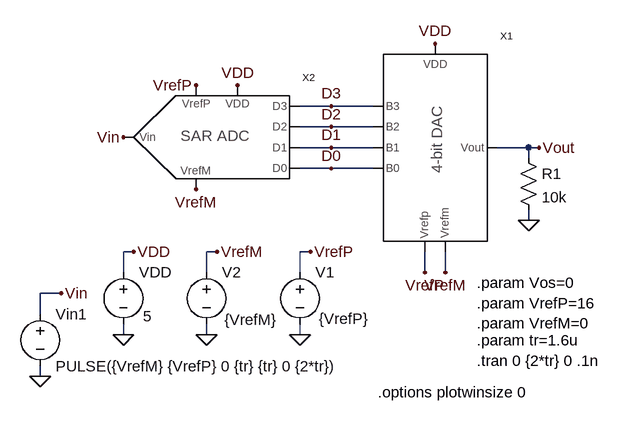
[diagram p0: schematic Fig29_36.asc]
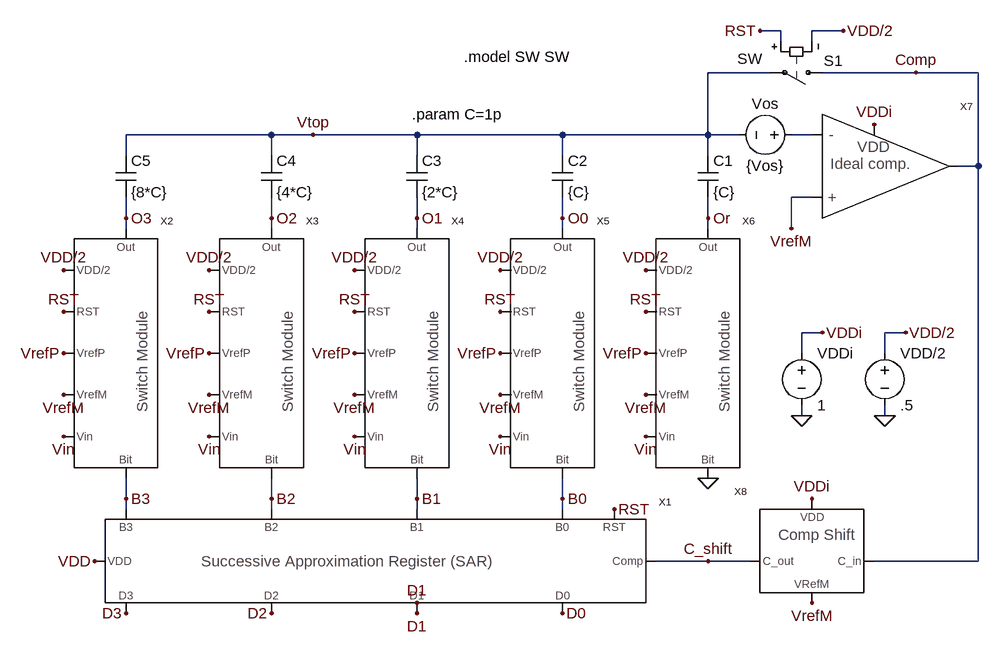
[diagram p1: sub-circuit sar_adc_4bit.asc]
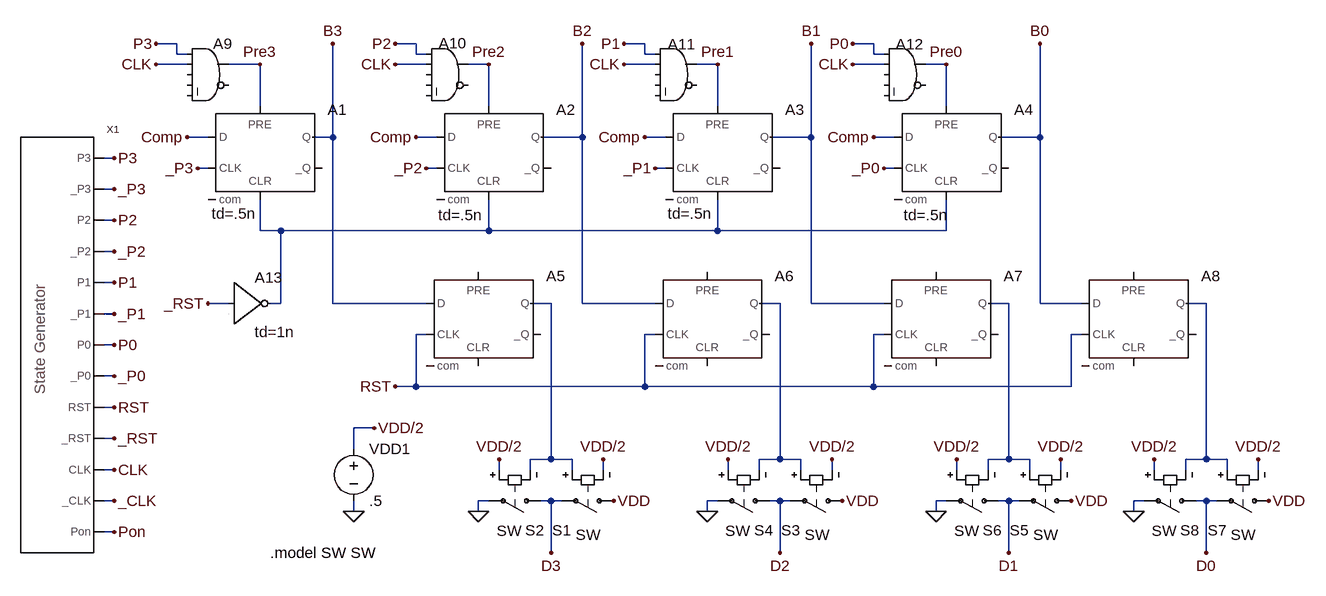
[diagram p2: sub-circuit successiveapproximationregister.asc]
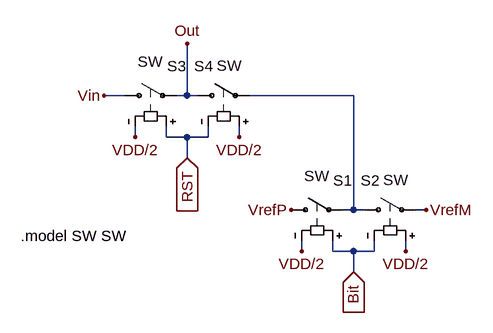
[diagram p3: sub-circuit switchmodule.asc]
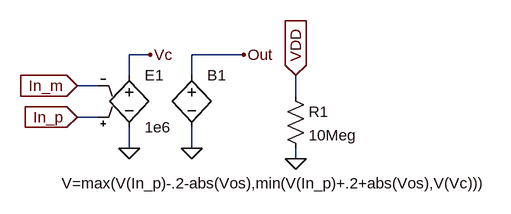
[diagram p4: sub-circuit idealcomparator.asc]
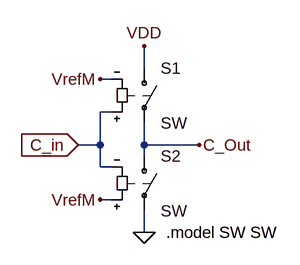
[diagram p5: sub-circuit compshift.asc]
Fig29_36.asc, the LTspice schematic file:
Version 4
SHEET 1 880 680
WIRE -496 -736 -544 -736
WIRE -432 -736 -496 -736
WIRE -496 -704 -544 -704
WIRE -432 -704 -496 -704
WIRE -496 -672 -544 -672
WIRE -432 -672 -496 -672
WIRE -192 -672 -240 -672
WIRE -176 -672 -192 -672
WIRE -192 -656 -192 -672
WIRE -496 -640 -544 -640
WIRE -432 -640 -496 -640
WIRE -192 -560 -192 -576
WIRE -800 -512 -816 -512
WIRE -672 -512 -688 -512
WIRE -528 -512 -544 -512
WIRE -816 -480 -816 -512
WIRE -688 -480 -688 -512
WIRE -544 -480 -544 -512
WIRE -352 -480 -352 -512
WIRE -320 -480 -320 -512
WIRE -912 -448 -944 -448
WIRE -944 -416 -944 -448
WIRE -816 -384 -816 -400
WIRE -688 -384 -688 -400
WIRE -544 -384 -544 -400
WIRE -944 -320 -944 -336
FLAG -944 -320 0
FLAG -544 -384 0
FLAG -912 -448 Vin
FLAG -336 -832 VDD
FLAG -496 -736 D3
FLAG -496 -704 D2
FLAG -496 -672 D1
FLAG -496 -640 D0
FLAG -176 -672 Vout
FLAG -688 -384 0
FLAG -672 -512 VrefM
FLAG -320 -480 VrefM
FLAG -816 -384 0
FLAG -800 -512 VDD
FLAG -352 -480 VrefP
FLAG -816 -688 Vin
FLAG -640 -768 VDD
FLAG -704 -768 VrefP
FLAG -528 -512 VrefP
FLAG -704 -608 VrefM
FLAG -192 -560 0
SYMBOL voltage -544 -496 R0
WINDOW 123 0 0 Left 0
WINDOW 39 0 0 Left 0
WINDOW 3 29 87 Left 0
SYMATTR Value {VrefP}
SYMATTR InstName V1
SYMBOL voltage -944 -432 R0
WINDOW 123 0 0 Left 0
WINDOW 39 0 0 Left 0
SYMATTR InstName Vin1
SYMATTR Value PULSE({VrefM} {VrefP} 0 {tr} {tr} 0 {2*tr})
SYMBOL Ideal_4_bit_DAC -416 -528 R0
SYMATTR InstName X1
SYMBOL voltage -688 -496 R0
WINDOW 123 0 0 Left 0
WINDOW 39 0 0 Left 0
WINDOW 3 28 89 Left 0
SYMATTR Value {VrefM}
SYMATTR InstName V2
SYMBOL voltage -816 -496 R0
WINDOW 123 0 0 Left 0
WINDOW 39 0 0 Left 0
WINDOW 3 30 83 Left 0
SYMATTR Value 5
SYMATTR InstName VDD
SYMBOL SAR_ADC_4Bit -800 -688 R0
SYMATTR InstName X2
SYMBOL res -208 -672 R0
SYMATTR InstName R1
SYMATTR Value 10k
TEXT -272 -344 Left 0 !.tran 0 {2*tr} 0 .1n
TEXT -272 -464 Left 0 !.param Vos=0\n.param VrefP=16\n.param VrefM=0
TEXT -272 -376 Left 0 !.param tr=1.6u
TEXT -424 -296 Left 0 !.options plotwinsize 0

sar_adc_4bit.asc, the sub-circuit schematic file:
Version 4
SHEET 1 1416 680
WIRE 912 -640 880 -640
WIRE 1008 -640 960 -640
WIRE 912 -624 912 -640
WIRE 960 -624 960 -640
WIRE 896 -576 800 -576
WIRE 1120 -576 976 -576
WIRE 1216 -576 1120 -576
WIRE 128 -480 -96 -480
WIRE 192 -480 128 -480
WIRE 352 -480 192 -480
WIRE 576 -480 352 -480
WIRE 800 -480 800 -576
WIRE 800 -480 576 -480
WIRE 848 -480 800 -480
WIRE 960 -480 928 -480
WIRE -96 -448 -96 -480
WIRE 128 -448 128 -480
WIRE 352 -448 352 -480
WIRE 576 -448 576 -480
WIRE 800 -448 800 -480
WIRE 1216 -432 1216 -576
WIRE 1216 -432 1184 -432
WIRE 960 -384 928 -384
WIRE -96 -352 -96 -384
WIRE 128 -352 128 -384
WIRE 352 -352 352 -384
WIRE 576 -352 576 -384
WIRE 800 -352 800 -384
WIRE -96 -336 -96 -352
WIRE 128 -336 128 -352
WIRE 352 -336 352 -352
WIRE 576 -336 576 -352
WIRE 800 -336 800 -352
WIRE 928 -336 928 -384
WIRE 976 -176 944 -176
WIRE 1104 -176 1072 -176
WIRE 944 -144 944 -176
WIRE 1072 -144 1072 -176
WIRE 944 -48 944 -64
WIRE 1072 -48 1072 -64
WIRE -96 80 -96 48
WIRE 128 80 128 48
WIRE 352 80 352 48
WIRE 576 80 576 48
WIRE -96 96 -96 80
WIRE 128 96 128 80
WIRE 352 96 352 80
WIRE 576 96 576 80
WIRE 800 176 720 176
WIRE 864 176 800 176
WIRE 1216 176 1216 -432
WIRE 1216 176 1056 176
FLAG 656 96 RST
FLAG -192 -208 RST
FLAG 32 -208 RST
FLAG 256 -208 RST
FLAG 480 -208 RST
FLAG 1072 -48 0
FLAG -192 -16 Vin
FLAG 32 -16 Vin
FLAG 256 -16 Vin
FLAG 480 -16 Vin
FLAG 1104 -176 VDD/2
FLAG -192 -272 VDD/2
FLAG 32 -272 VDD/2
FLAG 256 -272 VDD/2
FLAG 480 -272 VDD/2
FLAG 576 256 D0
FLAG 352 240 D1
FLAG 128 256 D2
FLAG -96 256 D3
FLAG 944 -48 0
FLAG 976 -176 VDDi
FLAG 880 -640 RST
FLAG 576 -352 O0
FLAG 352 -352 O1
FLAG 128 -352 O2
FLAG -96 -352 O3
FLAG 576 80 B0
FLAG 352 80 B1
FLAG 128 80 B2
FLAG -96 80 B3
FLAG 1120 -576 Comp
FLAG 1008 -640 VDD/2
FLAG 192 -480 Vtop
FLAG 352 256 D1
FLAG 1056 -496 VDDi
FLAG -192 -80 VrefM
FLAG 32 -80 VrefM
FLAG 256 -80 VrefM
FLAG 480 -80 VrefM
FLAG 928 -336 VrefM
FLAG -144 176 VDD
FLAG 704 -208 RST
FLAG 704 -16 Vin
FLAG 704 -272 VDD/2
FLAG 704 -80 VrefM
FLAG 800 48 0
FLAG 800 -352 Or
FLAG 704 -144 VrefP
FLAG 480 -144 VrefP
FLAG 256 -144 VrefP
FLAG 32 -144 VrefP
FLAG -192 -144 VrefP
FLAG 960 240 VrefM
FLAG 960 80 VDDi
FLAG 800 176 C_shift
SYMBOL SuccessiveApproximationRegister -128 208 R0
SYMATTR InstName X1
SYMBOL SwitchModule -176 32 R0
SYMATTR InstName X2
SYMBOL SwitchModule 48 32 R0
SYMATTR InstName X3
SYMBOL SwitchModule 272 32 R0
SYMATTR InstName X4
SYMBOL SwitchModule 496 32 R0
SYMATTR InstName X5
SYMBOL voltage 1072 -160 R0
WINDOW 123 0 0 Left 0
WINDOW 39 0 0 Left 0
SYMATTR InstName VDD/2
SYMATTR Value .5
SYMBOL cap 784 -448 R0
SYMATTR InstName C1
SYMATTR Value {C}
SYMBOL cap 560 -448 R0
SYMATTR InstName C2
SYMATTR Value {C}
SYMBOL cap 336 -448 R0
SYMATTR InstName C3
SYMATTR Value {2*C}
SYMBOL cap 112 -448 R0
SYMATTR InstName C4
SYMATTR Value {4*C}
SYMBOL cap -112 -448 R0
SYMATTR InstName C5
SYMATTR Value {8*C}
SYMBOL voltage 944 -160 R0
WINDOW 123 0 0 Left 0
WINDOW 39 0 0 Left 0
SYMATTR InstName VDDi
SYMATTR Value 1
SYMBOL sw 992 -576 R90
WINDOW 0 -18 -15 VRight 0
WINDOW 3 -21 109 VRight 0
SYMATTR InstName S1
SYMBOL IdealComparator 976 -432 R0
SYMATTR InstName X7
SYMBOL voltage 944 -480 R90
WINDOW 0 -32 56 VBottom 0
WINDOW 3 32 56 VTop 0
WINDOW 123 0 0 Left 0
WINDOW 39 0 0 Left 0
SYMATTR InstName Vos
SYMATTR Value {Vos}
SYMBOL SwitchModule 720 32 R0
SYMATTR InstName X6
SYMBOL CompShift 1040 224 M0
SYMATTR InstName X8
TEXT 344 -512 Left 0 !.param C=1p
TEXT 424 -600 Left 0 !.model SW SW

successiveapproximationregister.asc, the sub-circuit schematic file:
Version 4
SHEET 1 1744 1132
WIRE -16 32 -48 32
WIRE 352 32 320 32
WIRE 704 32 672 32
WIRE 1056 32 1024 32
WIRE -16 48 -16 32
WIRE 0 48 -16 48
WIRE 352 48 352 32
WIRE 368 48 352 48
WIRE 704 48 704 32
WIRE 720 48 704 48
WIRE 1056 48 1056 32
WIRE 1072 48 1056 48
WIRE 0 64 -48 64
WIRE 112 64 64 64
WIRE 368 64 320 64
WIRE 464 64 432 64
WIRE 720 64 672 64
WIRE 816 64 784 64
WIRE 1072 64 1024 64
WIRE 1168 64 1136 64
WIRE 112 128 112 64
WIRE 464 128 464 64
WIRE 816 128 816 64
WIRE 1168 128 1168 64
WIRE 32 176 0 176
WIRE 224 176 224 32
WIRE 224 176 192 176
WIRE 384 176 352 176
WIRE 608 176 608 32
WIRE 608 176 544 176
WIRE 736 176 704 176
WIRE 960 176 960 32
WIRE 960 176 896 176
WIRE 1088 176 1056 176
WIRE 1312 176 1312 32
WIRE 1312 176 1248 176
WIRE -112 208 -128 208
WIRE 32 224 16 224
WIRE 384 224 368 224
WIRE 736 224 720 224
WIRE 1088 224 1072 224
WIRE -112 256 -128 256
WIRE -112 304 -128 304
WIRE 112 320 112 272
WIRE 144 320 112 320
WIRE 464 320 464 272
WIRE 464 320 144 320
WIRE 816 320 816 272
WIRE 816 320 464 320
WIRE 1168 320 1168 272
WIRE 1168 320 816 320
WIRE -112 352 -128 352
WIRE -112 400 -128 400
WIRE 64 432 32 432
WIRE 144 432 144 320
WIRE 144 432 128 432
WIRE 224 432 224 176
WIRE 368 432 224 432
WIRE 560 432 528 432
WIRE 608 432 608 176
WIRE 720 432 608 432
WIRE 912 432 880 432
WIRE 960 432 960 176
WIRE 1072 432 960 432
WIRE 1264 432 1232 432
WIRE 1312 432 1312 176
WIRE 1376 432 1312 432
WIRE 1568 432 1536 432
WIRE -112 448 -128 448
WIRE 368 480 352 480
WIRE 720 480 704 480
WIRE 1072 480 1056 480
WIRE 1376 480 1360 480
WIRE -112 496 -128 496
WIRE -112 544 -128 544
WIRE 352 560 352 480
WIRE 352 560 320 560
WIRE 704 560 704 480
WIRE 704 560 352 560
WIRE 1056 560 1056 480
WIRE 1056 560 704 560
WIRE 1360 560 1360 480
WIRE 1360 560 1056 560
WIRE -112 592 -128 592
WIRE 288 624 256 624
WIRE -112 640 -128 640
WIRE 256 656 256 624
WIRE 560 672 560 432
WIRE 560 672 528 672
WIRE 592 672 560 672
WIRE 912 672 912 432
WIRE 912 672 880 672
WIRE 944 672 912 672
WIRE 1264 672 1264 432
WIRE 1264 672 1232 672
WIRE 1296 672 1264 672
WIRE 1568 672 1568 432
WIRE 1568 672 1536 672
WIRE 1600 672 1568 672
WIRE -112 688 -128 688
WIRE 480 688 480 672
WIRE 528 688 528 672
WIRE 592 688 592 672
WIRE 640 688 640 672
WIRE 832 688 832 672
WIRE 880 688 880 672
WIRE 944 688 944 672
WIRE 992 688 992 672
WIRE 1184 688 1184 672
WIRE 1232 688 1232 672
WIRE 1296 688 1296 672
WIRE 1344 688 1344 672
WIRE 1488 688 1488 672
WIRE 1536 688 1536 672
WIRE 1600 688 1600 672
WIRE 1648 688 1648 672
WIRE -112 736 -128 736
WIRE 464 736 448 736
WIRE 560 736 544 736
WIRE 576 736 560 736
WIRE 816 736 800 736
WIRE 912 736 896 736
WIRE 928 736 912 736
WIRE 1168 736 1152 736
WIRE 1264 736 1248 736
WIRE 1280 736 1264 736
WIRE 1472 736 1456 736
WIRE 1568 736 1552 736
WIRE 1584 736 1568 736
WIRE 256 752 256 736
WIRE 448 752 448 736
WIRE 800 752 800 736
WIRE 1152 752 1152 736
WIRE 1456 752 1456 736
WIRE -112 784 -128 784
WIRE 560 816 560 736
WIRE 912 816 912 736
WIRE 1264 816 1264 736
WIRE 1568 816 1568 736
FLAG -112 208 P3
FLAG -112 304 P2
FLAG -112 400 P1
FLAG -112 496 P0
FLAG -112 256 _P3
FLAG -112 352 _P2
FLAG -112 448 _P1
FLAG -112 544 _P0
FLAG -112 592 RST
FLAG -112 640 _RST
FLAG -112 688 CLK
FLAG -112 736 _CLK
FLAG -112 784 Pon
FLAG 1024 32 P0
FLAG 672 32 P1
FLAG 320 32 P2
FLAG -48 32 P3
FLAG 320 560 RST
FLAG 32 432 _RST
FLAG 0 176 Comp
FLAG 352 176 Comp
FLAG 704 176 Comp
FLAG 1056 176 Comp
FLAG -48 64 CLK
FLAG 320 64 CLK
FLAG 672 64 CLK
FLAG 1024 64 CLK
FLAG 1072 224 _P0
FLAG 720 224 _P1
FLAG 368 224 _P2
FLAG 16 224 _P3
FLAG 1312 32 B0
FLAG 960 32 B1
FLAG 608 32 B2
FLAG 224 32 B3
FLAG 1568 816 D0
FLAG 1264 816 D1
FLAG 912 816 D2
FLAG 560 816 D3
FLAG 1168 64 Pre0
FLAG 816 64 Pre1
FLAG 464 64 Pre2
FLAG 112 64 Pre3
FLAG 448 752 0
FLAG 656 736 VDD
FLAG 640 672 VDD/2
FLAG 480 672 VDD/2
FLAG 800 752 0
FLAG 1008 736 VDD
FLAG 992 672 VDD/2
FLAG 832 672 VDD/2
FLAG 1152 752 0
FLAG 1360 736 VDD
FLAG 1344 672 VDD/2
FLAG 1184 672 VDD/2
FLAG 1456 752 0
FLAG 1664 736 VDD
FLAG 1648 672 VDD/2
FLAG 1488 672 VDD/2
FLAG 256 752 0
FLAG 288 624 VDD/2
SYMBOL Digital\\dflop 112 128 R0
WINDOW 3 -74 166 Left 0
SYMATTR Value td=.5n
SYMATTR InstName A1
SYMBOL Digital\\dflop 464 128 R0
WINDOW 3 -78 168 Left 0
SYMATTR Value td=.5n
SYMATTR InstName A2
SYMBOL Digital\\dflop 816 128 R0
WINDOW 3 -77 166 Left 0
SYMATTR Value td=.5n
SYMATTR InstName A3
SYMBOL Digital\\dflop 448 384 R0
SYMATTR InstName A5
SYMBOL Digital\\dflop 800 384 R0
SYMATTR InstName A6
SYMBOL Digital\\dflop 1152 384 R0
SYMATTR InstName A7
SYMBOL Digital\\dflop 1456 384 R0
SYMATTR InstName A8
SYMBOL StateGen -256 672 R0
SYMATTR InstName X1
SYMBOL Digital\\and 32 16 R0
SYMATTR InstName A9
SYMBOL Digital\\and 400 16 R0
WINDOW 0 -13 15 Left 0
SYMATTR InstName A10
SYMBOL Digital\\and 752 16 R0
WINDOW 0 -13 17 Left 0
SYMATTR InstName A11
SYMBOL Digital\\and 1104 16 R0
WINDOW 0 -14 17 Left 0
SYMATTR InstName A12
SYMBOL Digital\\inv 64 368 R0
SYMATTR InstName A13
SYMATTR Value td=1n
SYMBOL sw 672 736 R90
WINDOW 0 45 81 VRight 0
WINDOW 3 52 36 VRight 0
SYMATTR InstName S1
SYMBOL sw 560 736 R90
WINDOW 0 45 40 VLeft 0
WINDOW 3 46 84 VLeft 0
SYMATTR InstName S2
SYMBOL sw 1024 736 R90
WINDOW 0 45 81 VRight 0
WINDOW 3 52 36 VRight 0
SYMATTR InstName S3
SYMBOL sw 912 736 R90
WINDOW 0 45 40 VLeft 0
WINDOW 3 46 84 VLeft 0
SYMATTR InstName S4
SYMBOL sw 1376 736 R90
WINDOW 0 45 81 VRight 0
WINDOW 3 52 36 VRight 0
SYMATTR InstName S5
SYMBOL sw 1264 736 R90
WINDOW 0 45 40 VLeft 0
WINDOW 3 46 84 VLeft 0
SYMATTR InstName S6
SYMBOL sw 1680 736 R90
WINDOW 0 45 81 VRight 0
WINDOW 3 52 36 VRight 0
SYMATTR InstName S7
SYMBOL sw 1568 736 R90
WINDOW 0 45 40 VLeft 0
WINDOW 3 46 84 VLeft 0
SYMATTR InstName S8
SYMBOL voltage 256 640 R0
WINDOW 123 0 0 Left 0
WINDOW 39 0 0 Left 0
SYMATTR InstName VDD1
SYMATTR Value .5
SYMBOL Digital\\dflop 1168 128 R0
WINDOW 3 -66 168 Left 0
SYMATTR Value td=.5n
SYMATTR InstName A4
TEXT 128 816 Left 0 !.model SW SW

switchmodule.asc, the sub-circuit schematic file:
Version 4
SHEET 1 880 680
WIRE -176 -32 -208 -32
WIRE -80 -32 -80 -112
WIRE -80 -32 -96 -32
WIRE -64 -32 -80 -32
WIRE 176 -32 16 -32
WIRE -160 32 -160 16
WIRE -112 32 -112 16
WIRE -80 32 -112 32
WIRE -48 32 -48 16
WIRE -48 32 -80 32
WIRE 0 32 0 16
WIRE -80 64 -80 32
WIRE 176 144 176 -32
WIRE 176 144 160 144
WIRE 192 144 176 144
WIRE 288 144 272 144
WIRE 96 208 96 192
WIRE 144 208 144 192
WIRE 176 208 144 208
WIRE 208 208 208 192
WIRE 208 208 176 208
WIRE 256 208 256 192
WIRE 176 240 176 208
FLAG 176 240 Bit
IOPIN 176 240 In
FLAG 80 144 VrefP
FLAG 96 208 VDD/2
FLAG 256 208 VDD/2
FLAG -80 64 RST
IOPIN -80 64 In
FLAG -160 32 VDD/2
FLAG 0 32 VDD/2
FLAG -208 -32 Vin
FLAG -80 -112 Out
FLAG 288 144 VrefM
SYMBOL sw 64 144 R270
WINDOW 0 45 81 VRight 0
WINDOW 3 52 36 VRight 0
SYMATTR InstName S1
SYMBOL sw 176 144 R270
WINDOW 0 45 40 VLeft 0
WINDOW 3 46 84 VLeft 0
SYMATTR InstName S2
SYMBOL sw -192 -32 R270
WINDOW 0 45 81 VRight 0
WINDOW 3 52 36 VRight 0
SYMATTR InstName S3
SYMBOL sw -80 -32 R270
WINDOW 0 45 40 VLeft 0
WINDOW 3 46 84 VLeft 0
SYMATTR InstName S4
TEXT -336 184 Left 0 !.model SW SW

idealcomparator.asc, the sub-circuit schematic file:
Version 4
SHEET 1 880 680
WIRE -160 -16 -192 -16
WIRE -16 -16 -96 -16
WIRE -192 16 -192 -16
WIRE -96 16 -96 -16
WIRE -240 32 -272 32
WIRE 64 48 64 16
WIRE -240 80 -272 80
WIRE -192 128 -192 96
WIRE -96 128 -96 96
WIRE 64 144 64 128
FLAG -192 128 0
FLAG -96 128 0
FLAG -160 -16 Vc
FLAG -272 32 In_m
IOPIN -272 32 In
FLAG -272 80 In_p
IOPIN -272 80 In
FLAG -16 -16 Out
FLAG 64 16 VDD
IOPIN 64 16 In
FLAG 64 144 0
SYMBOL e2 -192 0 R0
SYMATTR InstName E1
SYMATTR Value 1e6
SYMBOL bv -96 0 R0
WINDOW 3 -200 182 Left 0
SYMATTR Value V=max(V(In_p)-.2-abs(Vos),min(V(In_p)+.2+abs(Vos),V(Vc)))
SYMATTR InstName B1
SYMBOL res 48 32 R0
SYMATTR InstName R1
SYMATTR Value 10Meg

compshift.asc, the sub-circuit schematic file:
Version 4
SHEET 1 880 680
WIRE 208 0 208 -32
WIRE 160 16 144 16
WIRE 160 64 144 64
WIRE 144 112 144 64
WIRE 144 112 112 112
WIRE 208 112 208 80
WIRE 288 112 208 112
WIRE 208 128 208 112
WIRE 144 144 144 112
WIRE 160 144 144 144
WIRE 160 192 144 192
WIRE 208 240 208 208
FLAG 112 112 C_in
IOPIN 112 112 In
FLAG 144 16 VrefM
FLAG 208 -32 VDD
FLAG 288 112 C_Out
FLAG 144 192 VrefM
FLAG 208 240 0
SYMBOL sw 208 -16 R0
SYMATTR InstName S1
SYMBOL sw 208 112 R0
SYMATTR InstName S2
TEXT 240 240 Left 0 !.model SW SW

The netlist it stands for:
* Fig29_36.asc
V1 VrefP 0 {VrefP}
Vin1 Vin 0 PULSE({VrefM} {VrefP} 0 {tr} {tr} 0 {2*tr})
XX1 D3 D2 D1 D0 Vout VrefP VrefM VDD Ideal_4_bit_DAC  ; pins B3 B2 B1 B0 Vout Vrefp Vrefm VDD
V2 VrefM 0 {VrefM}
VDD VDD 0 5
XX2 Vin D0 D1 D2 D3 VrefP VrefM VDD sar_adc_4bit
R1 Vout 0 10k

* block symbol definitions
.subckt sar_adc_4bit Vin D0 D1 D2 D3 VrefP VrefM VDD
XX1 C_shift B0 B1 B2 B3 RST D0 D1 D2 D3 VDD successiveapproximationregister
XX2 Vin B3 VrefM VDD/2 O3 RST VrefP switchmodule
XX3 Vin B2 VrefM VDD/2 O2 RST VrefP switchmodule
XX4 Vin B1 VrefM VDD/2 O1 RST VrefP switchmodule
XX5 Vin B0 VrefM VDD/2 O0 RST VrefP switchmodule
VDD/2 VDD/2 0 .5
C1 Vtop Or {C}
C2 Vtop O0 {C}
C3 Vtop O1 {2*C}
C4 Vtop O2 {4*C}
C5 Vtop O3 {8*C}
VDDi VDDi 0 1
S1 Comp Vtop RST VDD/2 SW
XX7 N001 VrefM Comp VDDi idealcomparator
Vos N001 Vtop {Vos}
XX6 Vin 0 VrefM VDD/2 Or RST VrefP switchmodule
XX8 Comp C_shift VDDi VrefM compshift
.param C=1p
.model SW SW
.ends sar_adc_4bit

.subckt successiveapproximationregister Comp B0 B1 B2 B3 RST D0 D1 D2 D3 VDD
A1 Comp 0 _P3 Pre3 N001 0 B3 0 DFLOP td=.5n
A2 Comp 0 _P2 Pre2 N001 0 B2 0 DFLOP td=.5n
A3 Comp 0 _P1 Pre1 N001 0 B1 0 DFLOP td=.5n
A5 B3 0 RST 0 0 0 N002 0 DFLOP
A6 B2 0 RST 0 0 0 N003 0 DFLOP
A7 B1 0 RST 0 0 0 N004 0 DFLOP
A8 B0 0 RST 0 0 0 N005 0 DFLOP
XX1 RST P0 P1 P2 P3 CLK _CLK _RST _P0 _P1 _P2 _P3 Pon StateGen  ; pins RST P0 P1 P2 P3 CLK _CLK _RST _P0 _P1 _P2 _P3 Pon
A9 P3 CLK 0 0 0 0 Pre3 0 AND
A10 P2 CLK 0 0 0 0 Pre2 0 AND
A11 P1 CLK 0 0 0 0 Pre1 0 AND
A12 P0 CLK 0 0 0 0 Pre0 0 AND
A13 _RST 0 0 0 0 N001 0 0 BUF td=1n
S1 VDD D3 N002 VDD/2 SW
S2 D3 0 VDD/2 N002 SW
S3 VDD D2 N003 VDD/2 SW
S4 D2 0 VDD/2 N003 SW
S5 VDD D1 N004 VDD/2 SW
S6 D1 0 VDD/2 N004 SW
S7 VDD D0 N005 VDD/2 SW
S8 D0 0 VDD/2 N005 SW
VDD1 VDD/2 0 .5
A4 Comp 0 _P0 Pre0 N001 0 B0 0 DFLOP td=.5n
.model SW SW
.ends successiveapproximationregister

.subckt switchmodule Vin Bit VrefM VDD/2 Out RST VrefP
S1 VrefP N001 Bit VDD/2 SW
S2 N001 VrefM VDD/2 Bit SW
S3 Vin Out RST VDD/2 SW
S4 Out N001 VDD/2 RST SW
.model SW SW
.ends switchmodule

.subckt idealcomparator In_m In_p Out VDD
E1 Vc 0 In_p In_m 1e6
B1 Out 0 V=max(V(In_p)-.2-abs(Vos),min(V(In_p)+.2+abs(Vos),V(Vc)))
R1 VDD 0 10Meg
.ends idealcomparator

.subckt compshift C_in C_out VDD VRefM
S1 VDD C_Out C_in VrefM SW
S2 C_Out 0 VrefM C_in SW
.model SW SW
.ends compshift

.tran 0 {2*tr} 0 .1n
.param Vos=0
.param VrefP=16
.param VrefM=0
.param tr=1.6u
.options plotwinsize 0
.backanno
.end